# EasyEDA Pro project EasyEDA-tinySpeak_2026-02-18.epro

# Schematic Schematic1_1
Board Name: Board1; Create Date: 2025-11-13; Page Name: P1; Project Name: Tinycore Sound; Schematic Name: Schematic1; Update Date: 2025-11-21; Company: EasyEDA.com; Page Size: A4; Version: V1.0
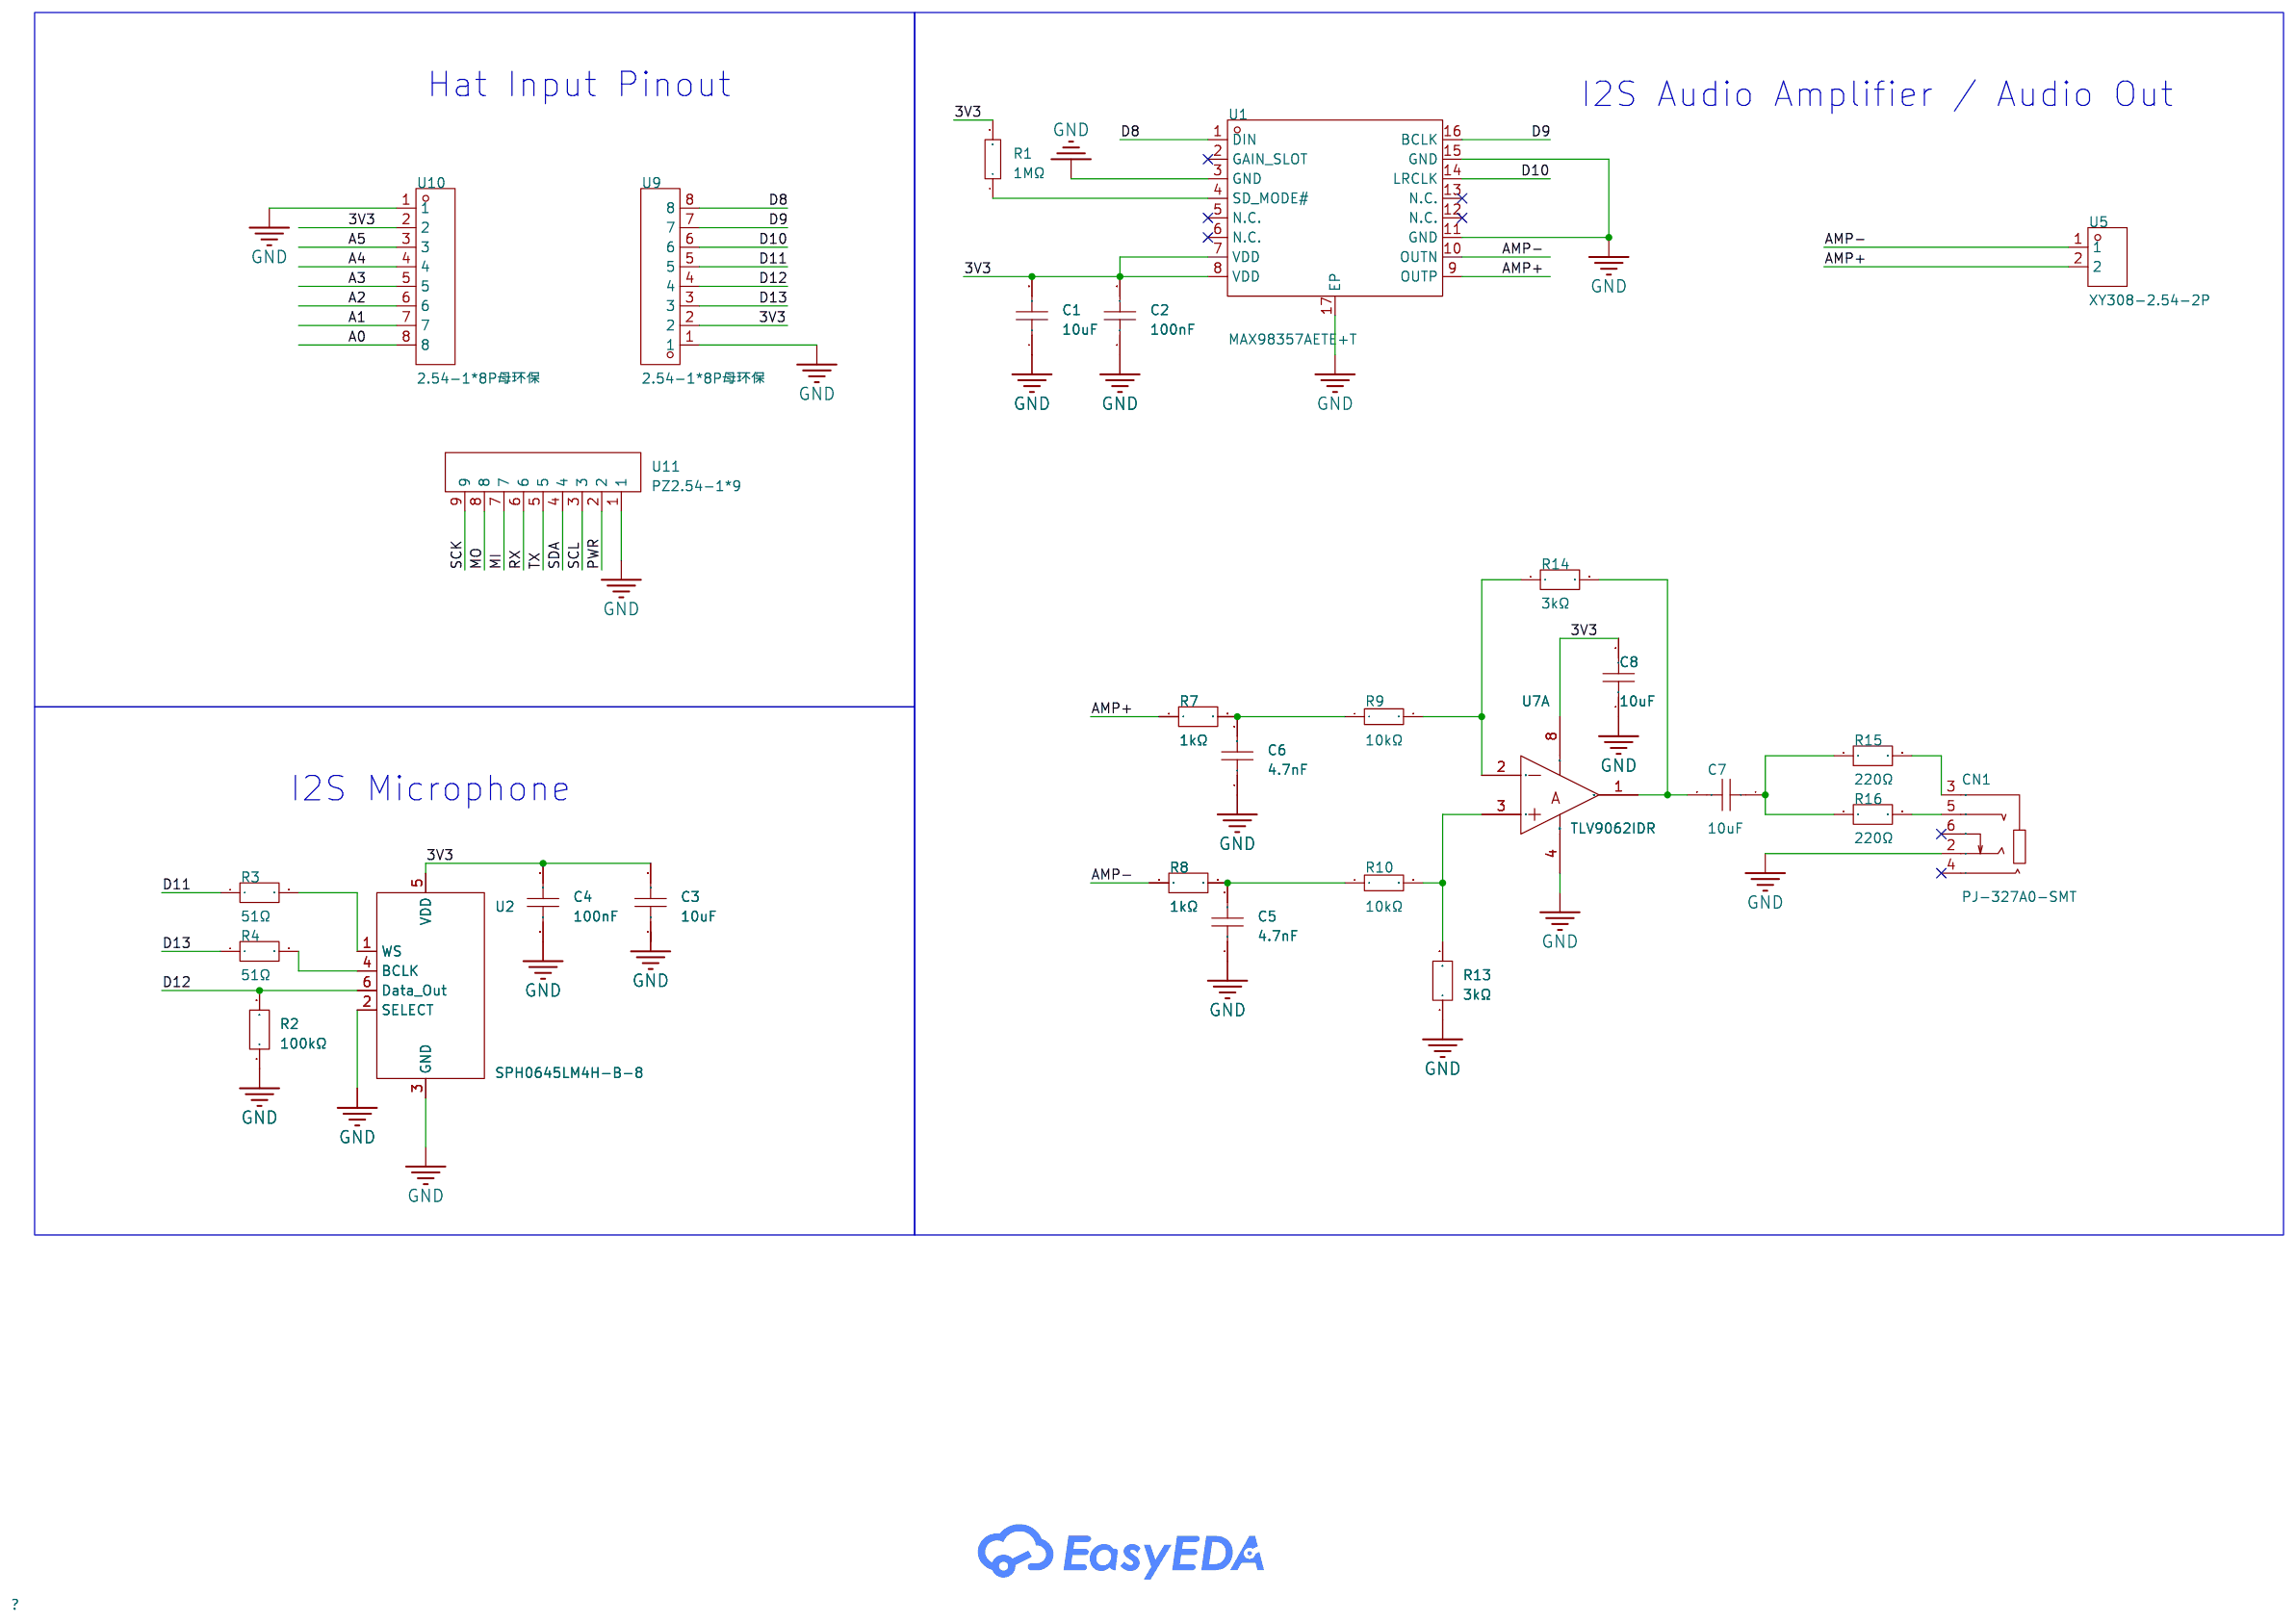
[diagram p0: schematic sheet]

## Parts
C1  10uF  [C0603]
C2  100nF  [C0603]
C3  10uF  [C0603]
C4  100nF  [C0603]
C5  4.7nF  [C0603]
C6  4.7nF  [C0603]
C7  10uF  [C0603]
C8  10uF  [C0603]
CN1  PJ-327A0-SMT  [AUDIO-SMD_PJ-327A0-SMT]
R1  1MΩ  [R0603]
R2  100kΩ  [R0603]
R3  51Ω  [R0603]
R4  51Ω  [R0603]
R7  1kΩ  [R0603]
R8  1kΩ  [R0603]
R9  10kΩ  [R0603]
R10  10kΩ  [R0603]
R13  3kΩ  [R0603]
R14  3kΩ  [R0603]
R15  220Ω  [R0603]
R16  220Ω  [R0603]
U1  MAX98357AETE+T  [TQFN-16_L3.0-W3.0-P0.50-BL-EP1.5]
U2  SPH0645LM4H-B-8  [MIC-SMD_6P-L3.5-W2.7-P0.90-BL]
U5  XY308-2.54-2P  [CONN-TH_XY308-2.54-2P]
U7  TLV9062IDR  [SOIC-8_L5.0-W4.0-P1.27-LS6.0-BL]  (section 1)
U9  2.54-1*8P母环保  [HDR-TH_8P-P2.54-V-F_2]
U10  2.54-1*8P母环保  [HDR-TH_8P-P2.54-V-F_2]
U11  PZ2.54-1*9  [HDR-TH_9P-P2.54-V-M]

## Library data of the parts
C1 C3 C7 C8 = TCC0603X5R106K160CT: Capacitance:10uF Tolerance:±10% Tolerance:±10% Voltage Rating:16V Temperature Coefficient:X5R; LCSC Part Name: 10uF ±10% 16V; Supplier Part: C18164635; Manufacturer: CCTC(三环); Supplier Footprint: 0603; Datasheet: https://item.szlcsc.com/datasheet/TCC0603X5R106K160CT/19306428.html; Supplier: LCSC; Tolerance: ±10%; Voltage Rating: 16V; Temperature Coefficient: X5R
C2 C4 = CC0603KRX7R9BB104: Capacitance:100nF Tolerance:±10% Tolerance:±10% Voltage Rating:50V Temperature Coefficient:X7R; LCSC Part Name: 100nF ±10% 50V; Supplier Part: C14663; Manufacturer: YAGEO(国巨); Supplier Footprint: 0603; JLCPCB Part Class: Basic Part; Datasheet: https://item.szlcsc.com/datasheet/CC0603KRX7R9BB104/15331.html; Supplier: LCSC; Tolerance: ±10%; Voltage Rating: 50V; Temperature Coefficient: X7R
C5 C6 = FN18N472J160PBG: Capacitance:4.7nF Tolerance:±5% Tolerance:±5% Voltage Rating:16V Temperature Coefficient:C0G; LCSC Part Name: 4.7nF ±5% 16V; Supplier Part: C22376401; Manufacturer: PSA(信昌电陶); Supplier Footprint: 0603; JLCPCB Part Class: Extended Part; Datasheet: https://item.szlcsc.com/datasheet/FN18N472J160PBG/23893302.html; Supplier: LCSC; Tolerance: ±5%; Voltage Rating: 16V; Temperature Coefficient: C0G
CN1 = PJ-327A0-SMT: Connector Type:3.5mm Headphone Jack Current Rating:500mA Voltage Rating (Max):30V Operating Temperature:-20℃~+70℃ Operating Temperature:-20℃~+70℃; LCSC Part Name: 3.5mm耳机座; Supplier Part: C381135; Manufacturer: XKB Connection(中国星坤); Supplier Footprint: SMD; JLCPCB Part Class: Extended Part; Datasheet: https://item.szlcsc.com/datasheet/PJ-327A0-SMT/353367.html; Supplier: LCSC; Connector Type: 3.5mm Headphone Jack; Current Rating: 500mA; Voltage Rating (Max): 30V; Operating Temperature: -20℃~+70℃
R1 = RC0603FR-071ML: Type:Thick Film Resistors Resistance: Tolerance:±1% Tolerance:±1% Power(Watts): Overload Voltage (Max): Temperature Coefficient:±100ppm/℃ Temperature Coefficient:±100ppm/℃ Operating Temperature Range:-55℃~+155℃ Operating Temperature Range:-55℃~+155℃; LCSC Part Name: 厚膜电阻 1MΩ ±1% 100mW; Supplier Part: C105578; Manufacturer: YAGEO(国巨); Supplier Footprint: 0603; JLCPCB Part Class: Extended Part; Datasheet: https://atta.szlcsc.com/upload/public/pdf/source/20181102/C105578_67A9388250AF143DE4682E62257D2969.pdf; Supplier: LCSC; Type: Thick Film Resistors; Tolerance: ±1%; Temperature Coefficient: ±100ppm/℃; Operating Temperature Range: -55℃~+155℃
R2 = FRC0603F1003TS: Type:Thick Film Resistor Resistance:100kΩ Tolerance:±1% Tolerance:±1% Power(Watts):100mW Voltage-Supply(Max):75V Temperature Coefficient:±100ppm/℃ Temperature Coefficient:±100ppm/℃ Operating Temperature:-55℃~+155℃ Operating Temperature:-55℃~+155℃; LCSC Part Name: 100kΩ ±1% 100mW 厚膜电阻; Supplier Part: C2906980; Manufacturer: FOJAN(富捷); Supplier Footprint: 0603; JLCPCB Part Class: Extended Part; Supplier: LCSC; Type: Thick Film Resistor; Tolerance: ±1%; Power(Watts): 100mW; Voltage-Supply(Max): 75V; Temperature Coefficient: ±100ppm/℃; Operating Temperature: -55℃~+155℃
R3 R4 = FRC0603J510 TS: Type:Thick Film Resistor Resistance:51Ω Tolerance:±5% Tolerance:±5% Power(Watts):100mW Voltage-Supply(Max):75V Temperature Coefficient:±100ppm/℃ Temperature Coefficient:±100ppm/℃ Operating Temperature:-55℃~+155℃ Operating Temperature:-55℃~+155℃; LCSC Part Name: 51Ω ±5% 100mW 厚膜电阻; Supplier Part: C2907181; Manufacturer: FOJAN(富捷); Supplier Footprint: 0603; JLCPCB Part Class: Extended Part; Supplier: LCSC; Type: Thick Film Resistor; Tolerance: ±5%; Power(Watts): 100mW; Voltage-Supply(Max): 75V; Temperature Coefficient: ±100ppm/℃; Operating Temperature: -55℃~+155℃
R7 R8 = FRR0603J102 TS: Type:Thick Film Resistor Resistance:1kΩ Tolerance:±5% Tolerance:±5% Power(Watts):100mW Voltage-Supply(Max):75V Temperature Coefficient:±100ppm/℃ Temperature Coefficient:±100ppm/℃ Operating Temperature:-55℃~+155℃ Operating Temperature:-55℃~+155℃; LCSC Part Name: 厚膜电阻 0603 1KΩ ±5% 100mW; Supplier Part: C49196793; Manufacturer: FOJAN(富捷); Supplier Footprint: 0603; JLCPCB Part Class: Extended Part; Datasheet: https://item.szlcsc.com/datasheet/FRR0603J102%2520TS/51599041.html; Supplier: LCSC; Type: Thick Film Resistor; Tolerance: ±5%; Power(Watts): 100mW; Voltage-Supply(Max): 75V; Temperature Coefficient: ±100ppm/℃; Operating Temperature: -55℃~+155℃
R9 R10 = RC0603FR-0710KL: Type:Thick Film Resistors Resistance: Tolerance:±1% Tolerance:±1% Power(Watts): Overload Voltage (Max): Temperature Coefficient:±100ppm/℃ Temperature Coefficient:±100ppm/℃ Operating Temperature Range:-55℃~+155℃ Operating Temperature Range:-55℃~+155℃; LCSC Part Name: 厚膜电阻 10kΩ ±1% 100mW; Supplier Part: C98220; Manufacturer: YAGEO(国巨); Supplier Footprint: 0603; JLCPCB Part Class: Extended Part; Datasheet: https://atta.szlcsc.com/upload/public/pdf/source/20180927/C295883_E8D83085EA81BD7DE0B2B681138C15EE.pdf; Supplier: LCSC; Type: Thick Film Resistors; Tolerance: ±1%; Temperature Coefficient: ±100ppm/℃; Operating Temperature Range: -55℃~+155℃
R13 R14 = FRC0603J302 TS: Type:Thick Film Resistor Resistance:3kΩ Tolerance:±5% Tolerance:±5% Power(Watts):100mW Voltage-Supply(Max):75V Temperature Coefficient:±100ppm/℃ Temperature Coefficient:±100ppm/℃ Operating Temperature:-55℃~+155℃ Operating Temperature:-55℃~+155℃; LCSC Part Name: 3kΩ ±5% 100mW 厚膜电阻; Supplier Part: C2907162; Manufacturer: FOJAN(富捷); Supplier Footprint: 0603; JLCPCB Part Class: Extended Part; Supplier: LCSC; Type: Thick Film Resistor; Tolerance: ±5%; Power(Watts): 100mW; Voltage-Supply(Max): 75V; Temperature Coefficient: ±100ppm/℃; Operating Temperature: -55℃~+155℃
R15 R16 = FRC0603F2200TS: Type:Thick Film Resistor Resistance:220Ω Tolerance:±1% Tolerance:±1% Power(Watts):100mW Voltage-Supply(Max):75V Temperature Coefficient:±100ppm/℃ Temperature Coefficient:±100ppm/℃ Operating Temperature:-55℃~+155℃ Operating Temperature:-55℃~+155℃; LCSC Part Name: 220Ω ±1% 100mW 厚膜电阻; Supplier Part: C2907014; Manufacturer: FOJAN(富捷); Supplier Footprint: 0603; JLCPCB Part Class: Extended Part; Supplier: LCSC; Type: Thick Film Resistor; Tolerance: ±1%; Power(Watts): 100mW; Voltage-Supply(Max): 75V; Temperature Coefficient: ±100ppm/℃; Operating Temperature: -55℃~+155℃
U1 = MAX98357AETE+T: Class:Class D Speaker Channels:- Output Power:3.2W×1@4Ω Voltage - Supply:2.5V~5.5V Voltage - Supply:2.5V~5.5V Total Harmonic Distortion + Noise (THD+N):- Quiescent Current:2.4mA Operating Temperature:-40℃~+85℃ Operating Temperature:-40℃~+85℃ Power Supply; LCSC Part Name: 微型、低成本、PCM 类 D 级放大器具有 AB 级性能; Supplier Part: C910544; Manufacturer: ADI(亚德诺)/MAXIM(美信); Supplier Footprint: TQFN-16-EP(3x3); JLCPCB Part Class: Extended Part; Datasheet: https://item.szlcsc.com/datasheet/MAX98357AETE%252BT/978950.html; Supplier: LCSC; Class: Class D; Output Power: 3.2W×1@4Ω; Voltage - Supply: 2.5V~5.5V; Quiescent Current: 2.4mA; Operating Temperature: -40℃~+85℃; Power Supply Rejection Ratio (PSRR): 77dB; Efficiency: 92%
U2 = SPH0645LM4H-B-8: Supplier Part: C19190864; Manufacturer: Knowles(楼氏); Supplier Footprint: SMD; JLCPCB Part Class: Extended Part; Datasheet: https://item.szlcsc.com/datasheet/SPH0645LM4H-B-8/20428820.html; Supplier: LCSC
U5 = XY308-2.54-2P: Number of Positions or Pins:1x2P Pitch:2.54mm Color:Green Mounting Type:Through Hole Number of Pins:2P Number of Rows:1 Number of PINs Per Row:2 Screw Specification:M1.6 Current Rating:6A Voltage Rating (Max):150V Wire Gauge - AWG:18~26 Wire Gauge - AWG:1; LCSC Part Name: 1x2P 2.54mm 直插 排数:1 每排P数:2; Supplier Part: C557685; Manufacturer: XINLAIYA(新莱亚); Supplier Footprint: 插件,P=2.54mm; JLCPCB Part Class: Extended Part; Datasheet: https://item.szlcsc.com/datasheet/XY308-2.54-2P/581048.html; Supplier: LCSC; Number of Positions or Pins: 1x2P; Pitch: 2.54mm; Color: Green; Mounting Type: Through Hole; Number of Pins: 2P; Number of Rows: 1; Number of PINs Per Row: 2; Screw Specification: M1.6; Current Rating: 6A; Voltage Rating (Max): 150V; Wire Gauge - AWG: 18~26; Wire Gauge - mm2: 1
U7 = TLV9062IDR: Number of Channels:2 Maximum Power Supply Range (Vdd-Vss):9V Rail to Rail:- Gain Bandwidth Product:- Vos - Input Offset Voltage:1.6mV Input Offset Voltage Drift(Vos TC):0.53uV/℃ Slew Rate:6.5V/us Ib - Input Bias Current:0.5pA Input Offset Current(Ios):- N; LCSC Part Name: 适用于成本敏感型系统的10MHz、轨到轨输入输出（RRIO）CMOS运算放大器; Supplier Part: C398355; Manufacturer: TI(德州仪器); Supplier Footprint: SOIC-8; JLCPCB Part Class: Extended Part; Datasheet: https://www.ti.com/cn/lit/gpn/tlv9061; Supplier: LCSC; Number of Channels: 2; Maximum Power Supply Range (Vdd-Vss): 9V; Vos - Input Offset Voltage: 1.6mV; Input Offset Voltage Drift(Vos TC): 0.53uV/℃; Slew Rate: 6.5V/us; Ib - Input Bias Current: 0.5pA; Noise density(eN): 10nV/√Hz@1kHz; Common Mode Rejection Ratio(CMRR): 103dB; Operating Temperature: -40℃~+125℃; Single supply: 1.8V~5.5V
U9 U10 = 2.54-1*8P母环保: Holes Structure:1x8P Pitch:2.54mm Row Spacing:- Circular Hole / Square Hole:Square Hole Mounting Type:Through Hole Number of Rows:1 Number of Positions:8P Holes Direction:Top Insulation Height:- Contact Material:- Contact Plating:-; LCSC Part Name: 1x8P 间距:2.54mm 直插; Supplier Part: C27438; Manufacturer: BOOMELE(博穆精密); Supplier Footprint: 插件,P=2.54mm; JLCPCB Part Class: Extended Part; Datasheet: https://item.szlcsc.com/datasheet/2.54-1*8P%25E6%25AF%258D%25E7%258E%25AF%25E4%25BF%259D/28187.html; Supplier: LCSC; Holes Structure: 1x8P; Pitch: 2.54mm; Circular Hole / Square Hole: Square Hole; Mounting Type: Through Hole; Number of Rows: 1; Number of Positions: 8P; Holes Direction: Top
U11 = PZ2.54-1*9: Pin Structure:1x9P Pitch:2.54mm Circluar Pins/Square Pins:Pin Header Mounting Type:Through Hole Number of Rows:1 Number of Pins:9P Current Rating:2.5A Length of Mating Pin:6mm Insulation Height:2.54mm Length of End Connection Pin:3mm Contact Material:Bras; LCSC Part Name: 1x9P 间距:2.54mm 方针 直插; Supplier Part: C5360901; Manufacturer: ZHOURI(洲日); Supplier Footprint: 插件,P=2.54mm; JLCPCB Part Class: Extended Part; Datasheet: https://item.szlcsc.com/datasheet/PZ2.54-1*9/6180460.html; Supplier: LCSC; Pin Structure: 1x9P; Pitch: 2.54mm; Circluar Pins/Square Pins: Pin Header; Mounting Type: Through Hole; Number of Rows: 1; Number of Pins: 9P; Current Rating: 2.5A; Length of Mating Pin: 6mm; Insulation Height: 2.54mm; Length of End Connection Pin: 3mm; Contact Material: Brass; Contact Plating: Gold; Operating Temperature: -40℃~+105℃

## Nets
3V3: C1.2 C2.2 C3.2 C4.2 C8.2 R1.2 U1.7(VDD) U1.8(VDD) U2.5(VDD) U7.8(VCC) U9.2 U10.2
GND: C1.1 C2.1 C3.1 C4.1 C5.1 C6.1 C8.1 CN1.2 R2.1 R13.1 U1.3(GND) U1.11(GND) U1.15(GND) U1.17(EP) U2.2(SELECT) U2.3(GND) U7.4(VEE/GND) U9.1 U10.1 U11.1
A0: U10.8
A1: U10.7
A2: U10.6
A3: U10.5
A4: U10.4
A5: U10.3
AMP+: R7.1 U1.9(OUTP) U5.2
AMP-: R8.1 U1.10(OUTN) U5.1
D8: U1.1(DIN) U9.8
D9: U1.16(BCLK) U9.7
D10: U1.14(LRCLK) U9.6
D11: R3.1 U9.5
D12: R2.2 U2.6(Data_Out) U9.4
D13: R4.1 U9.3
MI: U11.7
MO: U11.8
PWR: U11.2
RX: U11.6
SCK: U11.9
SCL: U11.3
SDA: U11.4
TX: U11.5
$1N1706: R1.1 U1.4(SD_MODE#)
$1N2036: R3.2 U2.1(WS)
$1N2590: R4.2 U2.4(BCLK)
$1N4578: C5.2 R8.2 R10.1
$1N4614: C6.2 R7.2 R9.1
$1N5031: R10.2 R13.2 U7.3(INA+)
$1N5048: R9.2 R14.1 U7.2(INA-)
$1N5439: CN1.5 R16.2
$1N5444: C7.2 R14.2 U7.1(OUTA)
$1N5448: C7.1 R15.1 R16.1
$1N5497: CN1.3 R15.2

Not connected (* = marked no-connect by the designer): CN1 4* 6*; U1 2(GAIN_SLOT)* 5(N.C.)* 6(N.C.)* 12(N.C.)* 13(N.C.)*

## Notes on the sheet
- Hat Input Pinout
- I2S Audio Amplifier / Audio Out
- I2S Microphone

# Board PCB1_1
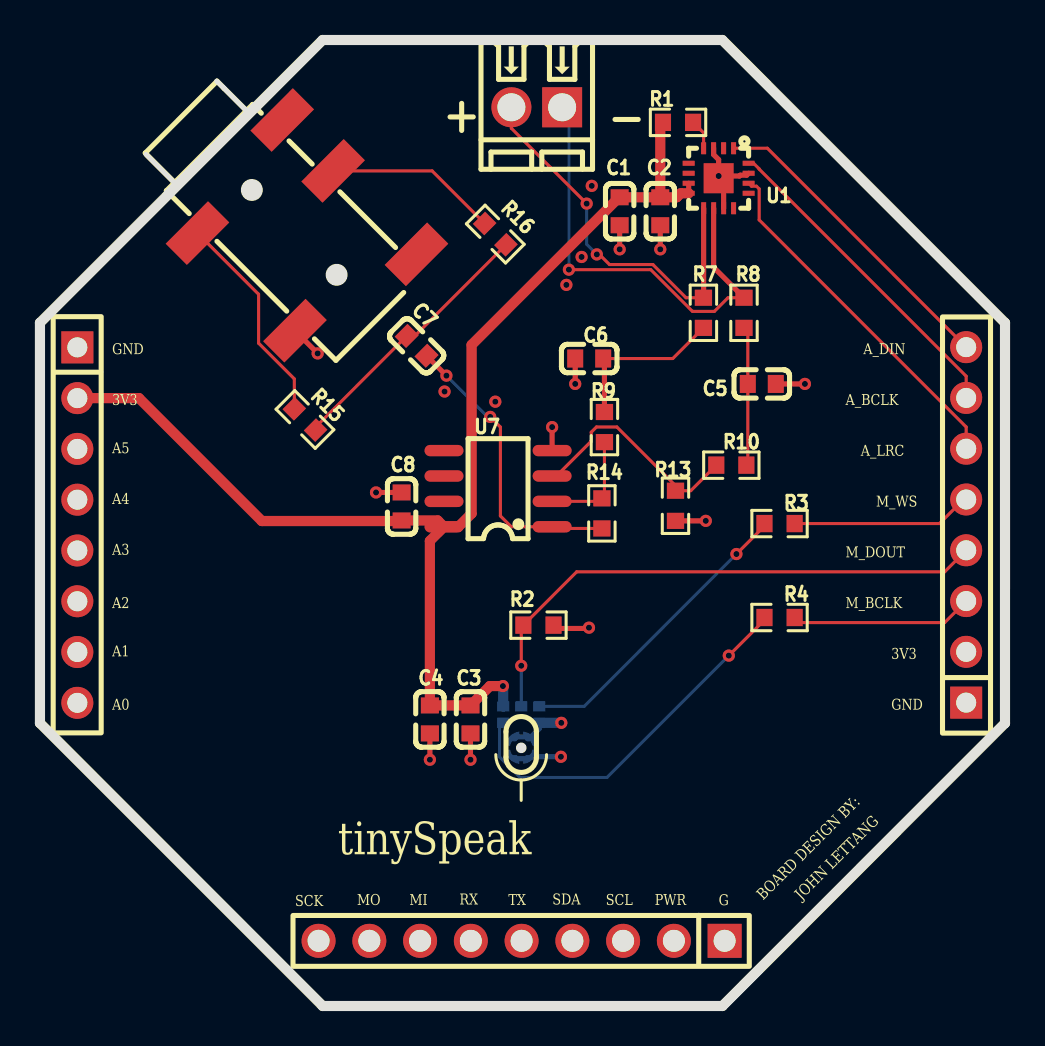
[diagram p1: board, top side]
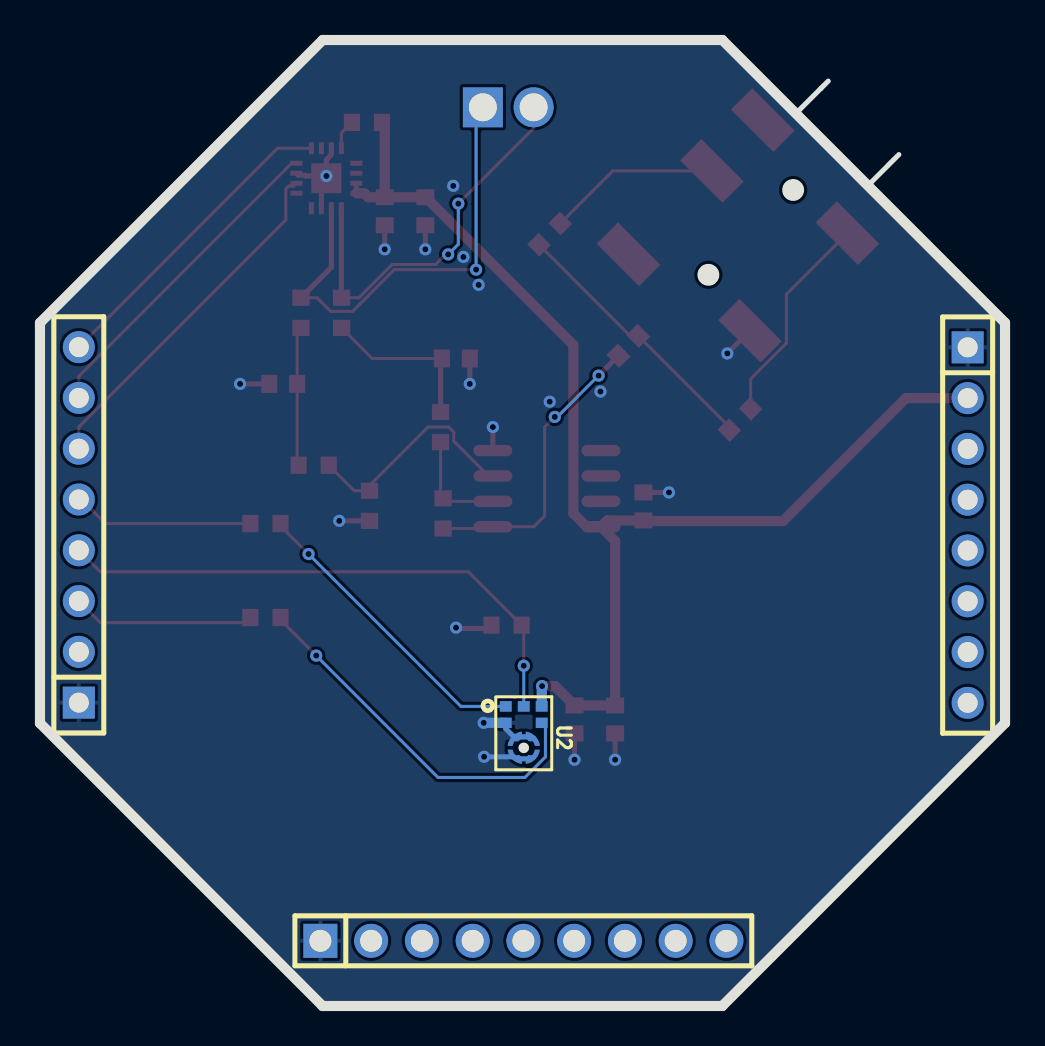
[diagram p2: board, bottom side, seen from below]

Outline 48.29 x 48.32 mm; copper layers: Top Layer, Inner1, Inner2, Bottom Layer. Coordinates in mm from the lower left corner of the outline.
Outline path: 0,14.15 0,34.17 14.14,48.32 34.15,48.32 48.29,34.17 48.29,14.14 34.15,0 14.15,0 0,14.15
Stack: Top Layer 0.035mm Outer layer thickness 1oz / Dielectric1 0.2104mm 7628 RC49% 8.6mil / Inner1 0.0152mm Inner layer thickness / Dielectric2 1.065mm 1.1mm H/HOZ Copper / Inner2 0.0152mm Inner layer thickness / Dielectric3 0.2104mm 7628 RC49% 8.6mil / Bottom Layer 0.035mm Outer layer thickness 1oz

## Design rules (mm)
template: JLCPCB Capability(Two Layers Board)
spacing copperThickness1oz (default): track to track 0.102, other pairs 0.152 to 0.3
spacing copperThickness2oz: track to track 0.203, other pairs 0.152 to 0.3
track width copperThickness1oz (default): min 0.127, default 0.254, max 2.54
track width copperThickness2oz: min 0.203, default 0.254, max 2.54
differential pair differentialPair (default): width min 0.127, default 0.254, max 2.54; gap min 0.152, default 0.152
via viaSize (default): diameter min 0.5, default 0.61, max 10; hole min 0.3, default 0.305, max 6.3

## Placement (name value [footprint] x y rotation side)
C1  10uF  [C0603]  29.01 39.75 90 top
C2  100nF  [C0603]  31.04 39.75 90 top
C3  10uF  [C0603]  21.54 14.33 90 top
C4  100nF  [C0603]  19.51 14.33 90 top
C5  4.7nF  [C0603]  36.12 31.11 180 top
C6  4.7nF  [C0603]  27.49 32.39 0 top
C7  10uF  [C0603]  18.85 33.02 315 top
C8  10uF  [C0603]  18.1 24.99 270 top
CN1  PJ-327A0-SMT  [AUDIO-SMD_PJ-327A0-SMT]  13.01 38.48 315 top
J1  2.54-1*8P母环保  [HDR-TH_8P-P2.54-V-F_2]  46.35 24.06 90 bottom
J2  2.54-1*8P母环保  [HDR-TH_8P-P2.54-V-F_2]  1.87 24.05 270 bottom
J3  PZ2.54-1*9  [HDR-TH_9P-P2.54-V-M]  24.1 3.26 180 bottom
R1  1MΩ  [R0603]  31.93 44.2 180 top
R2  100kΩ  [R0603]  24.95 19.05 180 top
R3  51Ω  [R0603]  37.01 24.13 180 top
R4  51Ω  [R0603]  37.01 19.43 180 top
R7  1kΩ  [R0603]  33.2 34.67 270 top
R8  1kΩ  [R0603]  35.23 34.67 270 top
R9  10kΩ  [R0603]  28.25 28.96 270 top
R10  10kΩ  [R0603]  34.6 27.05 180 top
R13  3kΩ  [R0603]  31.8 25.02 90 top
R14  3kΩ  [R0603]  28.12 24.64 270 top
R15  220Ω  [R0603]  13.26 29.34 135 top
R16  220Ω  [R0603]  22.79 38.61 135 top
U1  MAX98357AETE+T  [TQFN-16_L3.0-W3.0-P0.50-BL-EP1.5]  33.96 41.4 180 top
U2  SPH0645LM4H-B-8  [MIC-SMD_6P-L3.5-W2.7-P0.90-BL]  24.08 13.7 270 bottom
U5  XY308-2.54-2P  [CONN-TH_XY308-2.54-2P]  24.86 44.95 180 top
U7  TLV9062IDR  [SOIC-8_L5.0-W4.0-P1.27-LS6.0-BL]  22.92 25.88 90 top

## Footprints (pads in the part's own frame, mm; a bottom-side part is the same pattern mirrored in y, then rotated)
AUDIO-SMD_PJ-327A0-SMT
  rect 1.5x3 smd: 2(3.15,-3.5) 3(-3.75,-3.5) 4(-4.75,3.5) 5(-1.15,3.5) 6(4.75,3.5)
C0603
  rect 0.8x0.9 smd: 1(-0.7,0) 2(0.7,0)
CONN-TH_XY308-2.54-2P
  rect 2x2 hole 1.4: 1(-1.27,0)
  round 2 hole 1.4: 2(1.27,0)
HDR-TH_8P-P2.54-V-F_2
  rect 1.6x1.6 hole 1: 1(-8.89,0)
  round 1.6 hole 1: 2(-6.35,0) 3(-3.81,0) 4(-1.27,0) 5(1.27,0) 6(3.81,0) 7(6.35,0) 8(8.89,0)
HDR-TH_9P-P2.54-V-M
  rect 1.7x1.7 hole 1.1: 1(-10.16,0)
  round 1.7 hole 1.1: 2(-7.62,0) 3(-5.08,0) 4(-2.54,0) 5(0,0) 6(2.54,0) 7(5.08,0) 8(7.62,0) 9(10.16,0)
MIC-SMD_6P-L3.5-W2.7-P0.90-BL
  rect 0.52x0.6 smd: 1(-1.286,-0.9) 2(-0.465,-0.9) 4(-0.465,0.9) 5(-1.286,0.9) 6(-1.286,0)
  custom 0.709x0.71 smd: 3(0.276,-0.452) 3(0.329,0.505) 3(1.234,-0.505) 3(1.286,0.452)
R0603
  rect 0.806x0.864 smd: 1(-0.753,0) 2(0.753,0)
SOIC-8_L5.0-W4.0-P1.27-LS6.0-BL
  oval 0.569x1.95 smd: 1(-1.905,-2.705) 2(-0.635,-2.705) 3(0.635,-2.705) 4(1.905,-2.705) 5(1.905,2.705) 6(0.635,2.705) 7(-0.635,2.705) 8(-1.905,2.705)
TQFN-16_L3.0-W3.0-P0.50-BL-EP1.5
  rect 0.25x0.6 smd: 1(-0.749,-1.5) 2(-0.248,-1.5) 3(0.252,-1.5) 4(0.751,-1.5) 9(0.75,1.5) 10(0.25,1.5) 11(-0.25,1.5) 12(-0.749,1.5)
  rect 0.6x0.25 smd: 5(1.5,-0.748) 6(1.5,-0.248) 7(1.5,0.252) 8(1.5,0.752) 13(-1.5,0.752) 14(-1.5,0.252) 15(-1.5,-0.248) 16(-1.5,-0.748)
  rect 1.5x1.5 smd: 17(0,0)

## Nets
3V3: C1.2 C2.2 C3.2 C4.2 C8.2 J2.2 R1.2 U1.7 U1.8 U2.5 U7.8
GND: C1.1 C2.1 C3.1 C4.1 C5.1 C6.1 C8.1 CN1.2 J1.1 J2.1 J3.1 R2.1 R13.1 U1.3 U1.11 U1.15 U1.17 U2.2 U2.3 U7.4
A0: J2.8
A1: J2.7
A2: J2.6
A3: J2.5
A4: J2.4
A5: J2.3
AMP+: R7.1 U1.9 U5.2
AMP-: R8.1 U1.10 U5.1
D8: J1.8 U1.1
D9: J1.7 U1.16
D10: J1.6 U1.14
D11: J1.5 R3.1
D12: J1.4 R2.2 U2.6
D13: J1.3 R4.1
MI: J3.7
MO: J3.8
PWR: J3.2
RX: J3.6
SCK: J3.9
SCL: J3.3
SDA: J3.4
TX: J3.5
$1N1706: R1.1 U1.4
$1N2036: R3.2 U2.1
$1N2590: R4.2 U2.4
$1N4578: C5.2 R8.2 R10.1
$1N4614: C6.2 R7.2 R9.1
$1N5031: R10.2 R13.2 U7.3
$1N5048: R9.2 R14.1 U7.2
$1N5439: CN1.5 R16.2
$1N5444: C7.2 R14.2 U7.1
$1N5448: C7.1 R15.1 R16.1
$1N5497: CN1.3 R15.2

Pads without a net: CN1 4 6; J1 2; U1 2 5 6 12 13; U7 5 6 7

## Via types
v1: diameter 0.61, hole 0.305, Top Layer to Bottom Layer, 28 vias

## Routing (per net, layer and track width the routed paths; a pad name or vN(x,y) marks a point on that pad's centre or on a via; arc(x,y) is an arc through that point)
3V3: length 63.8
  Top Layer w0.254: U1.7 U1.8
  Top Layer w0.508: U7.8 19.9,24.29 C8.2 18.07,24.26 11.1,24.26 4.96,30.4 J2.2 ; U7.8 20.94,23.97 21.6,24.63 21.6,33.07 28.99,40.45 C1.2 C2.2 ; U7.8 19.51,23.26 C4.2 C3.2 22.51,16 v1(23.17,16) ; C2.2 31.87,40.45 32.07,40.65 U1.8 ; C2.2 31.04,44.06 R1.2 ; 1.86,30.42 1.91,30.47
  Bottom Layer w0.508: v1(23.17,16) 23.18,15.98 23.18,14.98
GND: length 25.7
  Top Layer w0.254: C2.1 v1(31.04,37.85) ; C6.1 v1(26.79,31.11) ; v1(27.47,18.92) 27.43,18.88 25.86,18.88 R2.1 ; v1(13.9,32.64) 13.9,32.64 CN1.2 ; U1.3 33.71,42.58 33.96,42.33 v1(33.96,41.51) ; v1(33.96,41.51) U1.17 34.21,41.15 U1.11 ; v1(33.96,41.51) 35.01,41.51 35.05,41.55 35.37,41.55 U1.15 ; C5.1 v1(38.28,31.11) ; 25.63,27.78 v1(25.63,28.96) ; R13.1 v1(33.32,24.27) 33.33,24.26 ; C8.1 v1(16.82,25.69) ; C1.1 v1(29.01,37.85) ; C4.1 v1(19.51,12.32) ; C3.1 v1(21.54,12.32)
  Top Layer w0.508: 1.86,32.96 1.91,33.01 ; 46.31,15.24 46.36,15.19
  Bottom Layer w0.254: U2.3 23.81,12.41 23.86,12.37 24.31,12.37 24.36,12.41 24.54,12.41 U2.3 v1(26.07,12.47) 26.09,12.45 ; U2.2 24.98,13.87 24.48,13.37 24.4,13.37 24.31,13.46 23.86,13.46 23.77,13.37 U2.3
  Bottom Layer w0.508: U2.2 v1(26.09,14.16)
  vias: v1(20.25,30.73) v1(22.79,30.23) v1(26.34,36.07) v1(27.1,37.46) v1(27.61,41.02)
A0: length 0.1
  Top Layer w0.152: 1.86,15.18 1.91,15.23
A1: length 0.1
  Top Layer w0.152: 1.86,17.72 1.91,17.77
A2: length 0.1
  Top Layer w0.152: 1.86,20.26 1.91,20.31
A3: length 0.1
  Top Layer w0.152: 1.86,22.8 1.91,22.85
A4: length 0.1
  Top Layer w0.152: 1.86,25.34 1.91,25.39
A5: length 0.1
  Top Layer w0.152: 1.86,27.88 1.91,27.93
AMP+: length 19.8
  Top Layer w0.152: v1(27.87,37.59) 27.99,37.59 28.5,37.08 30.67,37.08 32.33,35.42 R7.1 ; v1(27.36,40.13) 23.59,43.9 U5.2
  Top Layer w0.254: U1.9 33.21,35.44 R7.1
  Bottom Layer w0.152: v1(27.36,40.13) 27.36,38.1 v1(27.87,37.59)
AMP-: length 23.3
  Top Layer w0.152: R8.1 34.43,35.42 33.75,34.74 32.65,34.74 30.56,36.83 v1(26.47,36.83)
  Top Layer w0.254: R8.1 33.71,36.94 U1.10
  Bottom Layer w0.152: 26.13,44.95 26.47,44.61 v1(26.47,36.83)
D8: length 15.8
  Top Layer w0.152: U1.1 36.4,42.9 J1.8
D9: length 16.4
  Top Layer w0.152: U1.16 35.71,42.15 35.99,41.87 35.99,41.86 46.35,31.5 J1.7
D10: length 17.9
  Top Layer w0.152: J1.6 46.35,28.96 35.99,39.32 35.99,40.87 35.86,41 35.61,41 U1.14
D11: length 8.9
  Top Layer w0.152: J1.5 46.28,25.4 45.01,24.13 38.02,24.13
D12: length 27.9
  Top Layer w0.152: v1(24.08,17.02) 24.08,18.94 R2.2 26.86,21.72 45.27,21.72 J1.4 ; 46.31,22.86 46.36,22.81
  Bottom Layer w0.152: 24.08,14.98 v1(24.08,17.02)
D13: length 9.1
  Top Layer w0.152: J1.3 45.27,19.18 38.02,19.18 R4.1
$1N1706: length 1.5
  Top Layer w0.152: U1.4 33.21,43.67 R1.1
$1N2036: length 15.3
  Top Layer w0.152: v1(34.85,22.61) 36.38,24.13 36.51,24.13
  Bottom Layer w0.152: 24.98,14.98 27.23,14.98 v1(34.85,22.61)
$1N2590: length 18.8
  Top Layer w0.152: R4.2 36.26,19.31 v1(34.47,17.53)
  Bottom Layer w0.152: U2.4 23,13.98 23,12.46 24.03,11.43 28.37,11.43 v1(34.47,17.53)
$1N4578: length 7
  Top Layer w0.152: R8.2 35.42,33.73 C5.2 35.42,27.12 R10.1
$1N4614: length 8.4
  Top Layer w0.152: R7.2 31.67,32.39 C6.2
  Top Layer w0.254: R9.1 28.25,32.32 C6.2
$1N5031: length 11.5
  Top Layer w0.152: R10.2 32.57,25.77 R13.2 31.8,26.03 28.87,28.96 27.85,28.96 27.59,28.7 27.59,28.25 25.97,26.64 25.76,26.64 25.63,26.51
$1N5048: length 5.4
  Top Layer w0.152: 25.63,25.24 27.97,25.24 R14.1 28.25,25.52 R9.2
$1N5439: length 8.7
  Top Layer w0.152: R16.2 19.63,41.77 14.67,41.77
$1N5444: length 15
  Top Layer w0.152: v1(22.53,29.46) 23.04,28.96 23.04,24.51 23.58,23.97 25.63,23.97 25.72,23.88 R14.2
  Top Layer w0.254: v1(20.34,31.53) 19.34,32.52
  Bottom Layer w0.152: v1(22.53,29.46) 22.41,29.46 v1(20.34,31.53)
$1N5448: length 13.5
  Top Layer w0.152: R16.1 18.76,33.52 18.35,33.52 13.79,28.95 R15.1
$1N5497: length 10.8
  Top Layer w0.152: CN1.3 10.94,35.6 10.94,33.15 12.73,31.37 R15.2

## Copper pours and planes (outline as drawn; the poured copper is in the pictures)
GND on Bottom Layer: -0.07,0 48.21,0 48.21,48.26 -0.07,48.26
GND on Inner1: 14.15,0 0.05,14.1 -0.07,14.1 -0.07,34.04 14.15,48.26 33.96,48.26 34.09,48.39 48.31,34.16 48.31,14.22 34.09,0
GND on Inner2: 34.15,48.32 48.31,34.15 48.31,14.22 48.44,14.1 34.47,0.13 34.22,0.13 34.09,0 14.28,0 0.05,14.22 -0.07,14.22 -0.07,34.16 -0.2,34.29 13.83,48.32

## Text on the board
Top Silkscreen Layer: + | - | SCK | MO | MI | RX | TX | SDA | SCL | PWR | G | GND | 3V3 | A5 | A4 | A3 | A2 | A1 | A0 | A_BCLK | M_DOUT | M_BCLK | A_LRC | M_WS | A_DIN | BOARD DESIGN BY: | JOHN LETTANG | tinySpeak
